# EAGLE design PowerExtractor (EAGLE 6.6.0)
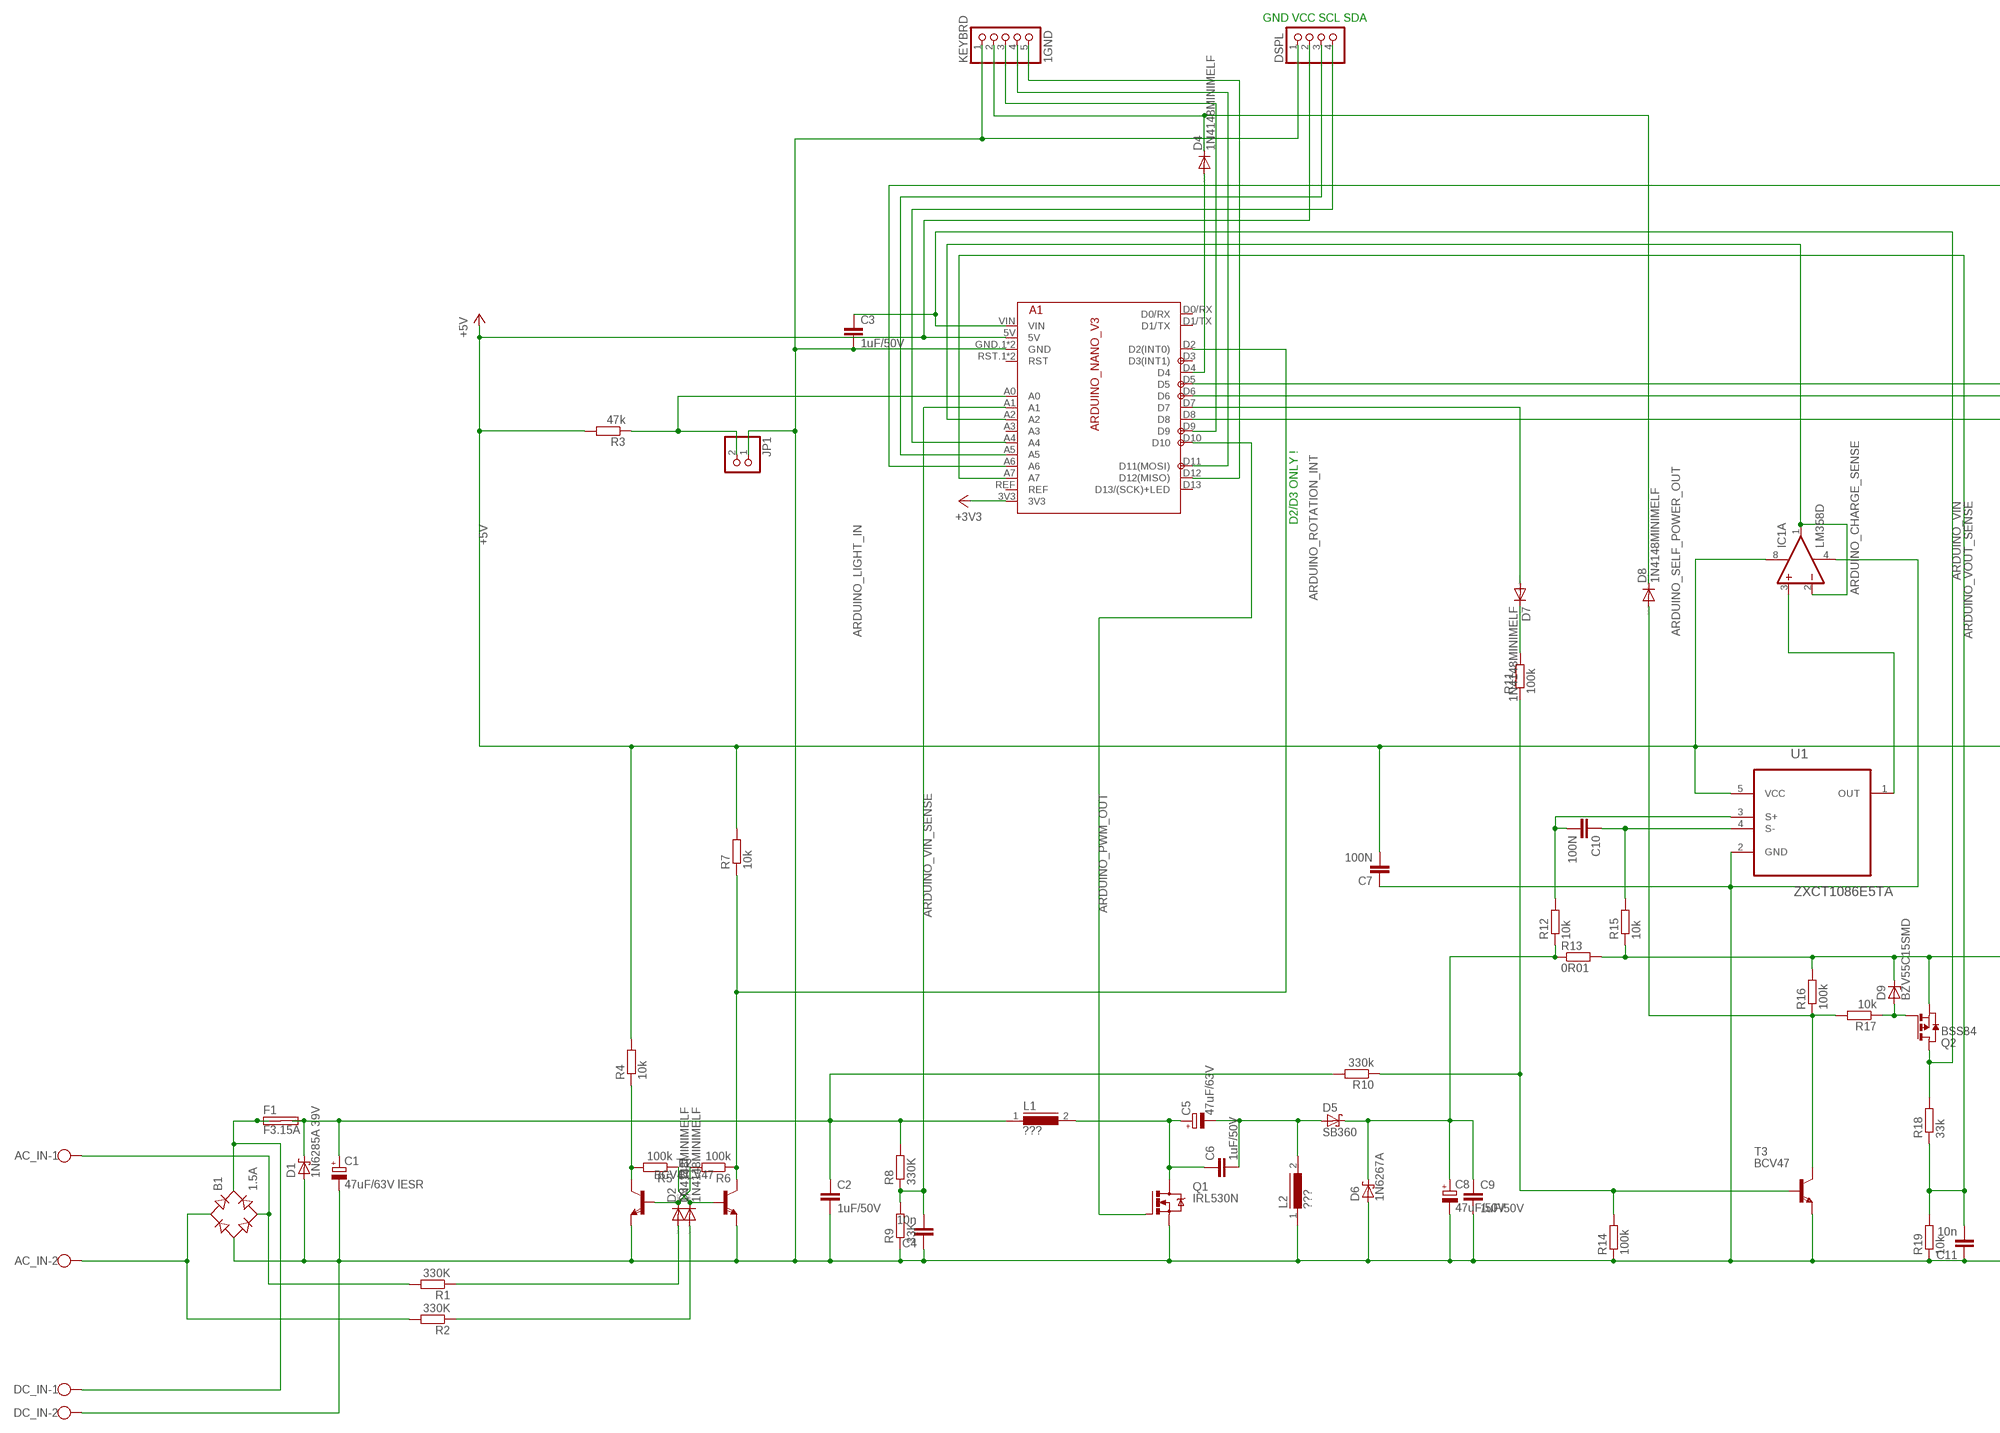
[diagram p0: schematic, sheet 1, part 1 of 2]
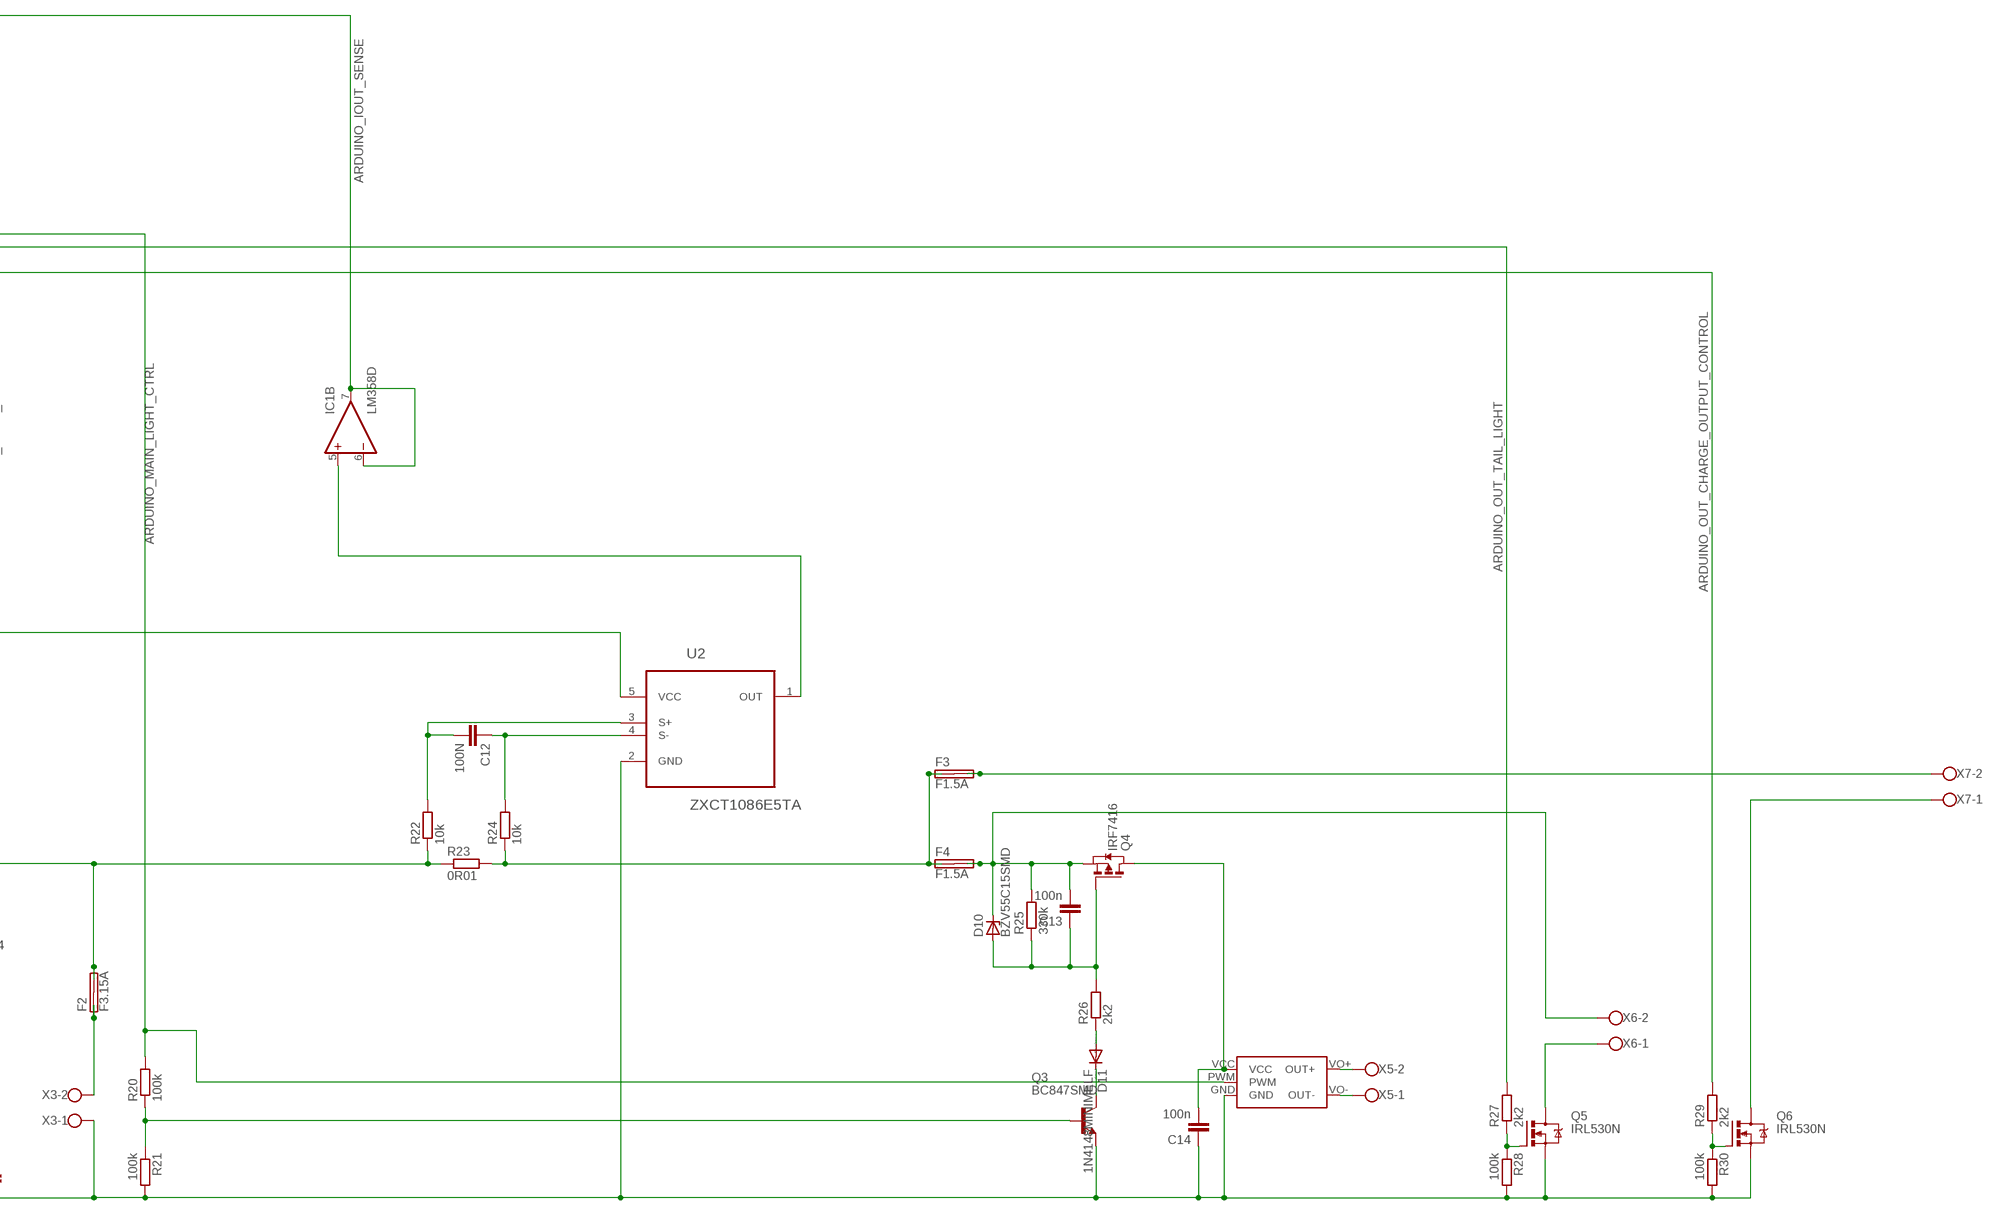
[diagram p1: schematic, sheet 1, part 2 of 2]

## Parts
A1  ARDUINO_NANO_V3  [ARDUINO_NANO_V3]
AC_IN  W237-102  [W237-102]
B1  1.5A  RB1A  [RB1A]
C1  47uF/63V lESR  CPOL-EUE5-8.5  [E5-8,5]
C2  1uF/50V  C-EUC0805  [C0805]
C3  1uF/50V  C-EUC0805  [C0805]
C4  10n  C-EUC0805  [C0805]
C5  47uF/63V  CPOL-EUE5-8.5  [E5-8,5]
C6  1uF/50V  C-EUC0805  [C0805]
C7  100N  C-EUC0805  [C0805]
C8  47uF/50V  CPOL-EUE5-8.5  [E5-8,5]
C9  1uF/50V  C-EUC0805  [C0805]
C10  100N  C-EUC0805  [C0805]
C11  10n  C-EUC0805  [C0805]
C12  100N  C-EUC0805  [C0805]
C13  100n  C-EUC0805  [C0805]
C14  100n  C-EUC0805  [C0805]
D1  1N6285A 39V  1N6267A  [C4111-15]
D2  1N4148MINIMELF  [SOD80C]
D3  1N4148MINIMELF  [SOD80C]
D4  1N4148MINIMELF  [SOD80C]
D5  SB360  1N5908  [C4111-15]
D6  1N6267A  [C4111-15]
D7  1N4148MINIMELF  [SOD80C]
D8  1N4148MINIMELF  [SOD80C]
D9  BZV55C15SMD  ZENER-DIODESOD80C  [SOD80C]
D10  BZV55C15SMD  ZENER-DIODESOD80C  [SOD80C]
D11  1N4148MINIMELF  [SOD80C]
DC_IN  W237-102  [W237-102]
DSPL  PINHD-1X4  [1X04]
F1  F3.15A  SHK20L  [SHK20L]
F2  F3.15A  SHK20L  [SHK20L]
F3  F1.5A  SHK20L  [SHK20L]
F4  F1.5A  SHK20L  [SHK20L]
IC1  LM358D  [SO08]
JP1  PINHD-1X2  [1X02]
KEYBRD  1GND  PINHD-1X5  [1X05]
L1  ???  SFT1030  [SFT1030]
L2  ???  SFT1030  [SFT1030]
Q1  IRL530N  IRF530  [TO220BV]
Q2  BSS84  [SOT23]
Q3  BC847SMD  [SOT23]
Q4  IRF7416  [SO-8]
Q5  IRL530N  IRF530  [TO220BV]
Q6  IRL530N  IRF530  [TO220BV]
R1  330K  R-EU_M0805  [M0805]
R2  330K  R-EU_M0805  [M0805]
R3  47k  R-EU_0207/10  [0207/10]
R4  10k  R-EU_M0805  [M0805]
R5  100k  R-EU_0207/10  [0207/10]
R6  100k  R-EU_R0805  [R0805]
R7  10k  R-EU_R0805  [R0805]
R8  330K  R-EU_M0805  [M0805]
R9  33K  R-EU_R0805  [R0805]
R10  330k  R-EU_R0805  [R0805]
R11  100k  R-EU_M0805  [M0805]
R12  10k  R-EU_M0805  [M0805]
R13  0R01  R-EU_M1206  [M1206]
R14  100k  R-EU_M0805  [M0805]
R15  10k  R-EU_M0805  [M0805]
R16  100k  R-EU_M0805  [M0805]
R17  10k  R-EU_M0805  [M0805]
R18  33k  R-EU_M0805  [M0805]
R19  10k  R-EU_M0805  [M0805]
R20  100k  R-EU_0207/10  [0207/10]
R21  100k  R-EU_M0805  [M0805]
R22  10k  R-EU_M0805  [M0805]
R23  0R01  R-EU_M1206  [M1206]
R24  10k  R-EU_M0805  [M0805]
R25  330k  R-EU_M0805  [M0805]
R26  2k2  R-EU_M0805  [M0805]
R27  2k2  R-EU_0207/10  [0207/10]
R28  100k  R-EU_M0805  [M0805]
R29  2k2  R-EU_0207/10  [0207/10]
R30  100k  R-EU_R0805  [R0805]
T1  BCV47  [SOT23]
T2  BCV47  [SOT23]
T3  BCV47  [SOT23]
U1  ZXCT1086E5TA  [SOT95P280X130-5N]
U2  ZXCT1086E5TA  [SOT95P280X130-5N]
X3  W237-102  [W237-102]
X4  LDD700L  [LDD_700L]
X5  W237-102  [W237-102]
X6  W237-102  [W237-102]
X7  W237-102  [W237-102]

## Nets
+3V3: A1.3V3
+5V: A1.5V C7.2 DSPL.2 IC1.8(P:V+) R3.2 R4.2 R7.2 U1.5(VCC) U2.5(VCC)
+OUT: F3.2A F3.2B X7.2
ARDUINO_CHARGE_SENSE: A1.A2 IC1.1(A:OUT) IC1.2(A:-IN)
ARDUINO_IOUT_SENSE: A1.A6 IC1.6(B:-IN) IC1.7(B:OUT)
ARDUINO_LIGHT_IN: A1.A0 JP1.2 R3.1
ARDUINO_MAIN_LIGHT_CTRL: A1.D5 R20.2 X4.PWM
ARDUINO_OUT_CHARGE_OUTPUT_CONTROL: A1.D8 R29.2
ARDUINO_OUT_TAIL_LIGHT: A1.D6 R27.2
ARDUINO_PWM_OUT: A1.D10 Q1.G
ARDUINO_ROTATION_INT: A1.D2(D2(INT0)) R6.1 R7.1 T2.3(C)
ARDUINO_SELF_POWER_OUT: A1.D7 D7.A
ARDUINO_VIN: A1.VIN C3.1 Q2.3(D) R18.2
ARDUINO_VIN_SENSE: A1.A1 C4.2 R8.1 R9.2
ARDUINO_VOUT_SENSE: A1.A7 C11.2 R18.1 R19.2
BAT+: F2.1A F2.1B X3.2
BAT+FUSED: D9.C F2.2A F2.2B Q2.2(S) R13.2 R15.1 R16.2 R22.1 R23.1
DISPLAY_SCL: A1.A5 DSPL.3
DISPLAY_SDA: A1.A4 DSPL.4
GND: A1.GND.1(GND) A1.GND.2(GND) B1.- C1.- C2.2 C3.2 C4.1 C7.1 C8.- C9.2 C11.1 C14.1 D1.A D6.A DC_IN.2 DSPL.1 IC1.4(P:V-) JP1.1 KEYBRD.1 L2.1 Q1.S Q3.2(E) Q5.S Q6.S R9.1 R14.1 R19.1 R21.2 R28.2 R30.2 T1.2(E) T2.2(E) T3.2(E) U1.2(GND) U2.2(GND) X3.1 X4.GND
HUB1: AC_IN.1 B1.AC2 R1.2
HUB2: AC_IN.2 B1.AC1 R2.2
LIGHTVCC: C13.2 D10.C F4.2A F4.2B Q4.1(S) Q4.2(S) Q4.3(S) R25.2 X6.2
N$1: C10.2 R12.2 U1.3(S+)
N$2: C5.+ C6.1 L1.2 Q1.D
N$3: C5.- C6.2 D5.A L2.2
N$4: R10.1 R11.1 R14.2 T3.1(B)
N$5: IC1.3(A:+IN) U1.1(OUT)
N$6: D4.C D8.C KEYBRD.2
N$7: D9.A Q2.1(G) R17.1
N$8: IC1.5(B:+IN) U2.1(OUT)
N$9: D11.C Q3.3(C)
N$10: B1.+ DC_IN.1 F1.1A F1.1B
N$12: D7.C R11.2
N$13: X4.VO+(OUT+) X5.2
N$14: C13.1 D10.A Q4.4(G) R25.1 R26.2
N$15: X4.VO-(OUT-) X5.1
N$16: C10.1 R15.2 U1.4(S-)
N$17: Q3.1(B) R20.1 R21.1
N$18: D11.A R26.1
N$19: C14.2 Q4.5(D) Q4.6(D) Q4.7(D) Q4.8(D) X4.VCC
N$22: D8.A R16.1 R17.2 T3.3(C)
N$24: Q5.G R27.1 R28.1
N$25: Q5.D X6.1
N$26: A1.D9 KEYBRD.3
N$27: Q6.G R29.1 R30.1
N$28: Q6.D X7.1
N$29: D2.A R1.1
N$30: R4.1 R5.2 T1.3(C)
N$31: D2.C R6.2 T1.1(B)
N$32: D3.C R5.1 T2.1(B)
N$37: A1.D11(D11(MOSI)) KEYBRD.4
N$38: D3.A R2.1
N$39: A1.D12(D12(MISO)) KEYBRD.5
N$41: A1.D4 D4.A
N$46: C12.2 R22.2 U2.3(S+)
N$47: C12.1 R24.2 U2.4(S-)
OUT+SENSED: F3.1A F3.1B F4.1A F4.1B R23.2 R24.1
OUTPUT_TO_SENSE: C8.+ C9.1 D5.C D6.C R12.1 R13.1
VIN: C1.+ C2.1 D1.C F1.2A F1.2B L1.1 R8.2 R10.2
Unconnected: A1.A3 A1.D0/RX A1.D1/TX A1.D3(D3(INT1)) A1.D13(D13/(SCK)+LED) A1.REF A1.RST.1(RST) A1.RST.2(RST)

## Notes on the sheet
- GND VCC SCL SDA
- D2/D3 ONLY !

## Library data of the parts
A1 = triakcz:ARDUINO_NANO_V3
AC_IN DC_IN X3 X5-X7 = con-wago-500:W237-102: WAGO SCREW CLAMP; MPN: 237-102; OC_FARNELL: unknown; OC_NEWARK: 70K9898
B1 = rectifier:RB1A: RECTIFIER 1 A
C1 C5 C8 = rcl:CPOL-EU: POLARIZED CAPACITOR, European symbol
C2-C4 C6 C7 C9-C14 = rcl:C-EU: CAPACITOR, European symbol
D1 D6 = diode:1N6267A: DIODE transient voltage suppressor
D2-D4 D7 D8 D11 = triakcz:1N4148: DIODE high speed (Philips)
D5 = diode:1N5908: DIODE schottky
D9 D10 = diode:ZENER-DIODE: Z-Diode
DSPL = pinhead:PINHD-1X4: PIN HEADER
F1-F4 = fuse:SHK20L: FUSE HOLDER 5 x 20 mm, SH contact, SHH1 Schukat, E1073 Buerklin; OC_FARNELL: unknown; OC_NEWARK: unknown
IC1 = linear:LM358: OP AMP also LM158; LM258; LM2904 Source: http://cache.national.com/ds/LM/LM158.pdf
JP1 = pinhead:PINHD-1X2: PIN HEADER
KEYBRD = pinhead:PINHD-1X5: PIN HEADER
L1 L2 = inductors:SFT1030: INDUCTOR
Q1 Q5 Q6 = transistor-power:IRF530: HEXFET Power MOSFET
Q2 = triakcz:BSS84: P-MOSFET -0.13 A -50 V RDS(ON) = 10 Ω @ Vgs = -5 V Vgsmax=20V
Q3 = triakcz:BC847*: NPN Transistor
Q4 = triakcz:IRF7416
R1-R30 = rcl:R-EU_: RESISTOR, European symbol
T1-T3 = triakcz:BCV47: BCV47 NPN DARL 60V 500mA H21e>20000
U1 U2 = triakcz:ZXCT1086E5TA: PRECISION HIGH VOLTAGE HIGH-SIDE CURRENT MONITORS; MPN: ZXCT1086E5TA; PACKAGE: SOT-25-5; SUPPLIER: DIODES INC.
X4 = triakcz:LDD700L

## Board
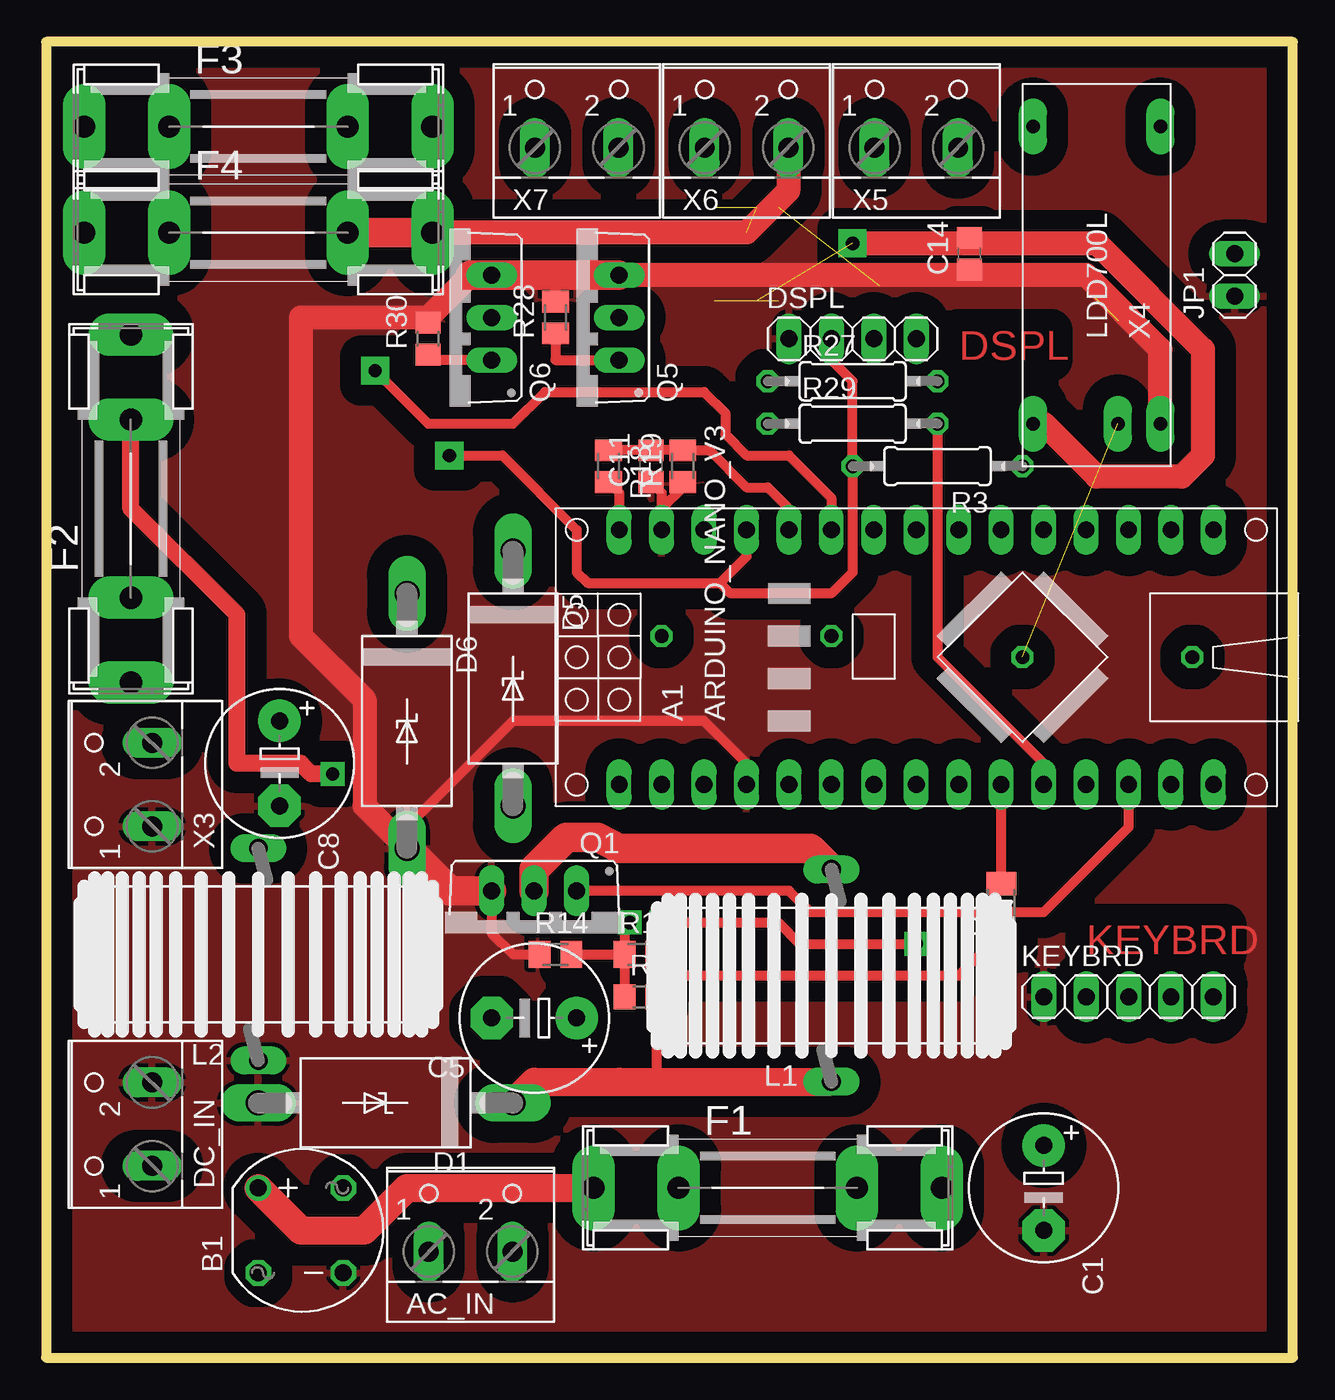
[diagram p2: board, top side]
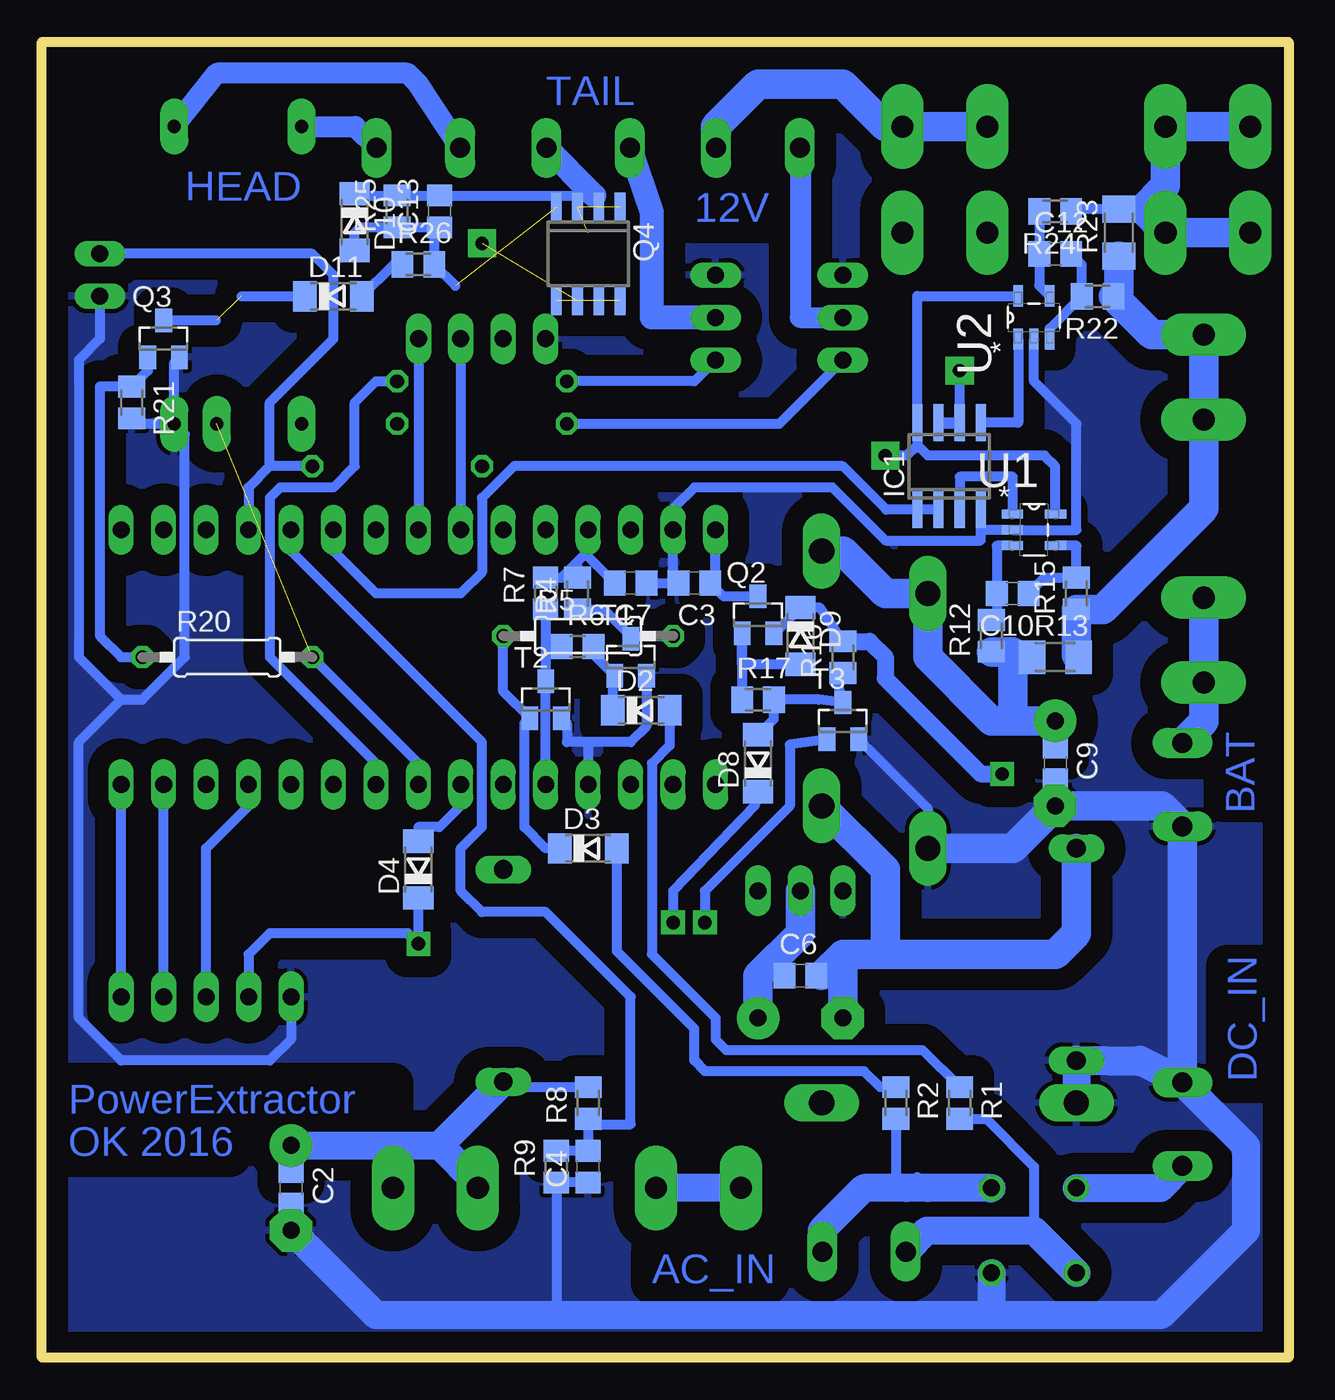
[diagram p3: board, bottom side, seen from below]

Size 74.6 x 78.73 mm. Coordinates in mm from the lower left corner, seen from the top.
Outline: 0,0 74.6,0 74.6,78.73 0,78.73 0,0
Copper layers (1*16): Top 0.035mm / dielectric 1.5mm / Bottom 0.035mm
Design rules "default": minimum track width 10mil, minimum drill 24mil, track to track 8mil, track to pad 8mil, pad to pad 8mil, via to via 8mil, smd to smd 8mil, copper to edge 40mil, drill to drill 8mil, minimum pad ring 10mil, minimum via ring 8mil, stop-mask expansion 4mil, vias tented up to drill 0mil, thermal gap 10mil

### Footprints (pad centres in the part's own frame; a part is rotated, then mirrored left to right if it is on the bottom)
ARDUINO_NANO_V3 = drill 1 long: 3V3 15.24,2.54; 5V 15.24,27.94; A0 15.24,7.62; A1 15.24,10.16; A2 15.24,12.7; A3 15.24,15.24; A4 15.24,17.78; A5 15.24,20.32; A6 15.24,22.86; A7 15.24,25.4; D0/RX 0,33.02; D1/TX 0,35.56; D2 0,25.4; D3 0,22.86; D4 0,20.32; D5 0,17.78; D6 0,15.24; D7 0,12.7; D8 0,10.16; D9 0,7.62; D10 0,5.08; D11 0,2.54; D12 0,0; D13 15.24,0; GND.1 0,27.94; GND.2 15.24,33.02; REF 15.24,5.08; RST.1 0,30.48; RST.2 15.24,30.48; VIN 15.24,35.56
W237-102 = drill 1.194 long: 1 -2.5,-1.27; 2 2.5,-1.27
RB1A = drill 1.016: + -2.54,2.54 | drill 1.016 octagon: - 2.54,-2.54; AC1 2.54,2.54; AC2 -2.54,-2.54
E5-8,5 = drill 1.016 pad 2.54: + -2.54,0 | drill 1.016 pad 2.54 octagon: - 2.54,0
C0805 = smd 1.3 x 1.5: 1 -0.95,0; 2 0.95,0
C4111-15 = drill 1.499 long: A 7.62,0; C -7.62,0
SOD80C = smd 1.4 x 1.8: A 1.7,0; C -1.7,0
1X04 = drill 1.016 long: 1 -3.81,0; 2 -1.27,0; 3 1.27,0; 4 3.81,0
SHK20L = drill 1.321 pad 2.54 long: 1A -10.414,0; 1B -5.334,0; 2A 10.414,0; 2B 5.334,0
SO08 = smd 0.6 x 2.2: 1 -1.905,-2.6; 2 -0.635,-2.6; 3 0.635,-2.6; 4 1.905,-2.6; 5 1.905,2.6; 6 0.635,2.6; 7 -0.635,2.6; 8 -1.905,2.6
1X02 = drill 1.016 long: 1 -1.27,0; 2 1.27,0
1X05 = drill 1.016 long: 1 -5.08,0; 2 -2.54,0; 3 0,0; 4 2.54,0; 5 5.08,0
SFT1030 = drill 1.118 long: 1 -6.35,0; 2 6.35,0
TO220BV = drill 1.016 long: D 0,-2.54; G -2.54,-2.54; S 2.54,-2.54
SOT23 = smd 1 x 1.4: 1 -0.95,-1.1; 2 0.95,-1.1; 3 0,1.1
SO-8 = smd 0.65 x 1.75: 1 -1.905,-2.8; 2 -0.635,-2.8; 3 0.635,-2.8; 4 1.905,-2.8; 5 1.905,2.8; 6 0.635,2.8; 7 -0.635,2.8; 8 -1.905,2.8
M0805 = smd 1.3 x 1.6: 1 -0.95,0; 2 0.95,0
0207/10 = drill 0.813 octagon: 1 -5.08,0; 2 5.08,0
R0805 = smd 1.3 x 1.5: 1 -0.95,0; 2 0.95,0
M1206 = smd 1.6 x 2: 1 -1.4,0; 2 1.4,0
SOT95P280X130-5N = smd 1.27 x 0.559: 1 -1.295,0.94; 2 -1.295,0; 3 -1.295,-0.94; 4 1.295,-0.94; 5 1.295,0.94
LDD_700L = drill 0.8 pad 1.676 long: GND 2.54,0.635; PWM 2.54,3.175; VCC 2.54,8.255; VO+ 20.32,8.255; VO- 20.32,0.635

### Placement (x,y rotation side)
A1  69.85,34.29 90 top
AC_IN  25.4,7.62 0 top
B1  15.24,7.62 0 top
C1  59.69,10.16 270 top
C2  59.69,10.16 270 bottom
C3  35.56,46.36 180 bottom
C4  41.91,11.43 90 bottom
C5  29.21,20.32 180 top
C6  29.21,22.86 0 bottom
C7  39.37,46.36 180 bottom
C8  13.97,35.56 270 top
C9  13.97,35.56 270 bottom
C10  16.51,45.72 180 bottom
C11  36.2,53.34 90 top
C12  13.97,66.04 0 bottom
C13  50.8,68.58 90 bottom
C14  55.24,66.04 90 top
D1  20.32,15.24 180 top
D2  38.73,38.73 0 bottom
D3  41.91,30.48 0 bottom
D4  52.07,29.21 90 bottom
D5  27.94,40.64 270 top
D6  21.59,38.1 270 top
D7  57.15,26.67 90 top
D8  31.75,35.56 90 bottom
D9  29.21,43.18 270 bottom
D10  55.88,67.94 270 bottom
D11  57.15,63.5 0 bottom
DC_IN  5.08,13.97 90 top
DSPL  48.26,60.96 0 top
F1  43.18,10.16 0 top
F2  5.08,50.8 90 top
F3  12.7,73.66 0 top
F4  12.7,67.31 0 top
IC1  20.32,53.34 0 bottom
JP1  71.12,64.77 90 top
KEYBRD  64.77,21.59 0 top
L1  46.99,22.86 90 top
L2  12.7,24.13 90 top
Q1  29.21,25.4 180 top
Q2  31.75,44.45 0 bottom
Q3  67.31,60.96 0 bottom
Q4  41.91,66.04 180 bottom
Q5  31.75,62.23 90 top
Q6  24.13,62.23 90 top
R1  19.68,15.24 270 bottom
R2  23.5,15.24 270 bottom
R3  53.34,53.34 180 top
R4  42.55,45.72 90 bottom
R5  41.91,43.18 0 bottom
R6  42.55,42.55 0 bottom
R7  44.45,45.72 90 bottom
R8  41.91,15.24 90 bottom
R9  43.81,11.43 90 bottom
R10  35.56,21.59 0 top
R11  35.56,24.13 0 top
R12  17.78,43.18 90 bottom
R13  13.97,41.91 0 bottom
R14  30.48,24.13 0 top
R15  12.7,45.72 90 bottom
R16  26.67,41.91 90 bottom
R17  31.75,39.37 0 bottom
R18  33.66,53.34 270 top
R19  38.1,53.34 90 top
R20  63.5,41.91 0 bottom
R21  69.22,57.15 270 bottom
R22  11.43,63.5 180 bottom
R23  10.16,67.31 90 bottom
R24  13.97,68.58 180 bottom
R25  53.34,68.58 90 bottom
R26  52.07,65.4 0 bottom
R27  48.26,58.42 0 top
R28  30.48,62.23 90 top
R29  48.26,55.88 0 top
R30  22.86,60.96 90 top
T1  39.37,41.91 0 bottom
T2  44.45,39.37 0 bottom
T3  26.67,38.1 0 bottom
U1  15.24,49.53 0 bottom
U2  15.24,62.23 90 bottom
X3  5.08,34.29 90 top
X4  67.31,53.34 90 top
X5  52.07,73.66 0 top
X6  41.91,73.66 0 top
X7  31.75,73.66 0 top

### Tracks (layer width: path | path; a pad name or v marks a point on that pad's centre or on a via)
+5V  (via drill 0.8 pad 1.68)
  Top 0.61: v24.13,53.98 27.3,53.98 31.75,49.53 31.75,46.99 32.38,46.36 C7.2 | C7.2 41.91,47.95 A1.5V | C7.2 40.95,45.72 46.99,45.72 48.26,46.99 R3.2 48.26,58.42 46.99,59.69 DSPL.2
  Bottom 0.61: C7.2 41.91,47.95 41.91,48.26 | 41.91,48.26 A1.5V | U2.5 22.23,63.52 IC1.8 22.23,54.61 | U1.5 13.97,50.49 13.97,53.34 14.61,53.98 21.59,53.98 22.23,54.61 | 22.23,54.61 22.86,53.98 v24.13,53.98 | R7.2 43.5,46.67 42.55,47.62 | R4.2 42.55,47.62 | 42.55,47.62 41.91,48.26
+OUT
  Bottom 0.61: F3.2A 24.13,73.66
  Bottom 1.778: F3.2B F3.2A | 24.13,73.66 26.67,76.2 31.75,76.2 34.29,73.66 34.29,72.43 X7.2
ARDUINO_CHARGE_SENSE
  Bottom 0.61: IC1.2 IC1.1 24.07,50.74 26.67,53.34 46.35,53.34 48.26,51.44 48.26,46.99 49.53,45.72 54.61,45.72 57.15,48.26 A1.A2
ARDUINO_IOUT_SENSE  (via drill 0.8 pad 1.68)
  Top 0.61: v19.68,59.05 22.86,55.88 27.94,55.88 29.84,57.79 39.37,57.79 40.64,56.52 40.64,55.24 41.91,53.98 44.45,53.98 46.99,51.44 A1.A6
  Bottom 0.61: IC1.6 IC1.7 20.95,55.88 19.68,55.88 v19.68,59.05
ARDUINO_LIGHT_IN
  Bottom 0.61: R3.1 60.96,53.34 | 60.96,53.34 62.23,52.07 A1.A0 | 60.96,53.34 60.96,57.15 57.15,60.96 57.15,64.77 58.42,66.04 JP1.2
ARDUINO_MAIN_LIGHT_CTRL  (1 unrouted)
  Bottom 0.61: R20.2 52.07,35.56 A1.D5
ARDUINO_OUT_CHARGE_OUTPUT_CONTROL
  Top 0.61: R29.2 53.34,41.91 59.69,35.56 A1.D8
ARDUINO_OUT_TAIL_LIGHT
  Bottom 0.61: A1.D6 54.61,35.56 60.96,41.91 60.96,51.44 60.33,52.07 57.15,52.07 55.88,53.34 55.88,57.15 54.61,58.42 R27.2
ARDUINO_PWM_OUT
  Top 0.61: A1.D10 64.77,31.75 59.69,26.67 45.72,26.67 44.45,27.94 Q1.G
ARDUINO_ROTATION_INT
  Bottom 0.61: R7.1 44.45,43.18 | 44.45,43.18 T2.3 A1.D2 | R6.1 43.81,42.55 44.45,43.18
ARDUINO_SELF_POWER_OUT
  Top 0.61: 57.15,33.02 A1.D7 D7.A
ARDUINO_VIN
  Top 0.61: R18.2 34.29,51.76 A1.VIN
  Bottom 0.61: A1.VIN 34.29,46.36 C3.1 33.8,45.55 Q2.3
ARDUINO_VIN_SENSE
  Bottom 0.61: A1.A1 59.69,48.26 48.26,36.83 48.26,31.75 49.53,30.48 49.53,27.94 48.26,26.67 44.45,26.67 39.37,21.59 39.37,13.97 41.91,13.97 R8.1 C4.2 R9.2
ARDUINO_VOUT_SENSE
  Top 0.61: A1.A7 44.45,50.8 43.18,52.07 41.91,52.07 39.69,54.29 R19.2 C11.2 R18.1
BAT+
  Bottom 1.778: F2.1B F2.1A 5.08,38.06 X3.2
BAT+FUSED  (via drill 0.8 pad 1.42)
  Top 1.016: v17.14,34.93 15.88,34.93 15.24,35.56 11.43,35.56 11.43,44.45 5.08,50.8 F2.2B
  Bottom 0.61: R13.2 12.7,42.04 | 10.16,63.82 R22.1 | R16.2 28.05,44.88 D9.C 30.74,43.35 Q2.2
  Bottom 1.016: R16.2 25.08,42.86 24.13,41.91 24.13,40.64 18.41,34.93 v17.14,34.93
  Bottom 1.778: 12.7,42.04 R15.1 11.11,44.77 5.08,50.8 F2.2B F2.2A 8.19,61.21 R22.1 | R23.1 10.16,63.82
DISPLAY_SCL
  Bottom 0.61: DSPL.3 A1.A5
DISPLAY_SDA
  Bottom 0.61: DSPL.4 A1.A4
GND
  Top 0.61: A1.GND.1 41.91,35.56 39.37,38.1 27.94,38.1 21.59,31.75 D6.A | R30.2 22.86,62.23 | R28.2 30.48,64.77 | C14.1 55.56,64.77 | R19.1 38.1,52.07 36.83,50.8 | C11.1 36.83,51.76 36.83,50.8 | 36.83,50.8 A1.GND.2 | Q1.S 26.67,25.4 27.94,24.13 R14.1
  Top 1.422: 25.4,64.77 22.86,62.23 15.24,62.23 15.24,43.18 19.05,39.37 19.05,33.02 D6.A | X4.GND 66.67,60.33 62.23,64.77 55.56,64.77 Q5.S
  Top 1.778: D6.A 24.13,27.94 Q1.S | Q5.S 30.48,64.77 Q6.S 25.4,64.77
  Bottom 0.61: 8.93,17.74 DC_IN.2 7.58,16.47 6.35,16.51 | L2.1 8.89,17.78 | C7.1 36.83,46.36 | 36.83,46.36 A1.GND.2 36.83,50.8 35.56,52.07 27.3,52.07 24.13,48.9 18.41,48.9 18.41,49.53 | C3.2 36.83,46.36 | 18.41,49.53 U1.2 12.7,49.53 12.7,55.88 15.24,58.42 U2.2 | C9.2 C8.- | IC1.4 18.41,49.53 | X4.GND 66.67,59.55 Q3.2 | R21.2 68.89,55.88 X4.GND | T2.2 43.18,37.95 43.18,36.83 41.91,36.83 | T1.2 38.42,37.78 39.37,36.83 41.91,36.83 | 41.91,36.83 A1.GND.1 | T3.2 21.59,32.87 D6.A | JP1.1 71.12,60.96 72.39,59.69 72.39,41.91 69.85,39.37 | 69.85,39.37 68.58,39.37 66.04,41.91 66.04,55.24 X4.GND | KEYBRD.1 59.69,19.05 60.96,17.78 69.85,17.78 72.39,20.32 72.39,36.83 69.85,39.37 | C4.1 R9.1 43.81,3.17 43.18,2.54
  Bottom 1.016: C1.- C2.2
  Bottom 1.676: DC_IN.2 2.54,12.66 2.54,7.62 7.62,2.54 17.78,2.54 | 17.78,2.54 43.18,2.54 54.61,2.54 C1.- | B1.- 17.78,2.54 | L2.1 D1.A
  Bottom 1.778: L2.1 8.93,17.74 | D6.A 16.51,30.48 C8.- 7.58,33.02 X3.1 6.35,16.51 8.89,17.78
  pour Top (isolate 1.27): 0,78.74 74.93,78.74 74.93,0 0,0
  pour Bottom (isolate 1.27): 0,78.74 74.93,78.74 74.93,0 0,0
HUB1
  Bottom 0.61: 15.24,7.62 15.24,11.43 18.1,14.29 R1.2
  Bottom 1.676: AC_IN.1 21.63,7.62 15.24,7.62 B1.AC2
HUB2
  Bottom 0.61: 22.23,10.8 21.59,10.16 | R2.2 23.5,10.8 22.86,10.16
  Bottom 1.676: B1.AC1 17.82,10.12 17.86,10.16 21.59,10.16 22.86,10.16 25.4,10.16 27.94,7.62 27.9,7.58 AC_IN.2
LIGHTVCC  (3 unrouted)
  Top 0.61: X6.2 44.41,71.38
  Top 1.422: X6.2 44.41,69.81 41.91,67.31 F4.2A
  Top 1.778: F4.2A F4.2B
  Bottom 0.61: 41.55,69.53 C13.2 R25.2 55.36,69.53 D10.C
  Bottom 1.422: 41.55,69.53 X6.2
N$1
  Bottom 0.61: U1.3 17.46,48.59 C10.2 17.46,44.45 R12.2
N$2
  Top 1.778: L1.2 45.72,30.48 34.29,30.48 33.02,31.12 31.11,31.12 29.21,29.21 Q1.D
  Bottom 0.61: C6.1 31.75,22.86
  Bottom 1.778: Q1.D 29.21,25.4 31.75,22.86 C5.+
N$3
  Bottom 0.61: 27.94,22.86 C6.2
  Bottom 1.778: C5.- 26.67,24.13 | L2.2 12.7,25.4 13.97,24.13 24.13,24.13 | 24.13,24.13 26.67,24.13 | D5.A 24.13,29.21 24.13,24.13 | 26.67,24.13 27.94,22.86
N$4  (via drill 0.8 pad 1.42)
  Top 0.61: R14.2 R11.1 | R11.1 R10.1 | v34.92,26.04 34.61,25.72 R11.1
  Bottom 0.61: T3.1 29.84,36.68 29.84,33.02 34.92,27.94 v34.92,26.04
N$5
  Bottom 0.61: U1.1 16.51,50.47 16.51,52.7 19.68,52.7 IC1.3
N$6  (via drill 0.8 pad 1.42)
  Top 0.61: v36.83,26.04 43.81,26.04 45.09,24.77 v52.07,24.77
  Bottom 0.61: D8.C 31.95,33.02 36.83,27.94 v36.83,26.04 | D4.C v52.07,24.77 52.7,25.4 60.96,25.4 62.23,24.13 KEYBRD.2
N$7
  Bottom 0.61: R17.1 Q2.1 32.7,41.48 D9.A
N$8
  Bottom 0.61: U2.1 16.18,55.94 IC1.5
N$9  (1 unrouted)
  Bottom 0.61: 64.17,62.06 Q3.3 | 62.66,63.5 D11.C
N$10
  Top 1.676: B1.+ 15.24,7.62 19.05,7.62 21.59,10.16 F1.1A
  Bottom 1.676: F1.1A F1.1B | B1.+ 7.66,10.16 DC_IN.1
N$12
  Top 0.61: R11.2 37.78,22.86 54.61,22.86 56.72,24.97 D7.C
N$13
  Bottom 1.27: X4.VO+ 55.84,73.66 X5.2
N$14  (1 unrouted)
  Bottom 0.61: D10.A 55.88,67.31 55.56,67.63 R25.1 C13.1 51.12,67.31 R26.2 49.85,64.13
N$15
  Bottom 1.27: X5.1 52.11,76.24 52.7,76.83 64.14,76.83 X4.VO-
N$16
  Bottom 0.61: C10.1 14.61,46.67 R15.2 12.7,48.59 U1.4
N$17
  Bottom 0.61: Q3.1 68.26,59.05 R21.1 71.12,58.1 71.12,43.18 69.85,41.91 R20.1
N$18
  Bottom 0.61: D11.A 53.55,65.4 R26.1
N$19  (via drill 0.8 pad 1.68)  (4 unrouted)
  Top 0.61: C14.2 54.93,66.67 54.61,66.67
  Top 1.422: v48.26,66.67 54.61,66.67 | 54.93,66.67 62.87,66.67 69.22,60.33 69.22,53.98 67.94,52.7 62.87,52.7 59.69,55.88 X4.VCC
N$22
  Bottom 0.61: R16.1 26.99,40.47 T3.3 28.11,39.37 R17.2 30.8,38.21 D8.A
N$24
  Top 0.61: R28.1 30.48,59.69 Q5.G
  Bottom 0.61: Q5.G 35.56,58.42 R27.1
N$25
  Bottom 1.422: Q5.D 38.1,62.23 38.1,68.54 X6.1
N$26
  Bottom 0.61: KEYBRD.3 64.77,30.48 62.23,33.02 A1.D9
N$27
  Top 0.61: Q6.G 23.18,59.69 R30.1
  Bottom 0.61: R29.1 30.48,55.88 Q6.G
N$28
  Bottom 0.61: 29.21,72.35 X7.1
  Bottom 1.27: 29.21,72.35 29.21,62.23 Q6.D
N$29
  Bottom 0.61: D2.A 37.03,36.62 38.1,35.56 38.1,24.13 34.29,20.32 34.29,19.05 33.66,18.41 21.91,18.41 R1.1
N$30
  Bottom 0.61: R4.1 40.96,44.77 39.37,43.18 | 39.37,43.18 R5.2 | T1.3 39.37,43.18
N$31
  Bottom 0.61: D2.C 40.44,40.7 T1.1 41.59,42.09 R6.2
N$32
  Bottom 0.61: R5.1 46.99,39.86 T2.1 45.72,37.95 45.72,31.75 44.45,30.48 D3.C
N$37
  Bottom 0.61: KEYBRD.4 A1.D11
N$38
  Bottom 0.61: D3.A 40.21,24.34 35.56,19.69 35.56,17.78 34.92,17.14 25.4,17.14 24.45,16.19 R2.1
N$39
  Bottom 0.61: KEYBRD.5 A1.D12
N$41
  Bottom 0.61: A1.D4 49.53,33.02 50.8,31.75 52.07,31.75 D4.A
N$46
  Bottom 0.61: U2.3 14.3,61.58 R22.2 12.38,65.4 C12.2
N$47
  Bottom 0.61: R24.2 C12.1 14.92,64.14 U2.4
OUT+SENSED
  Bottom 0.61: 8.77,68.71 R23.2 12.89,68.71 R24.1
  Bottom 1.778: F4.1A F4.1B 8.77,68.71 7.37,70.11 F3.1B F3.1A
OUTPUT_TO_SENSE
  Bottom 0.61: C9.1 C8.+ | R12.1 17.46,41.91 R13.1
  Bottom 1.778: D5.C 26.67,48.26 24.13,45.72 D6.C 21.59,41.91 17.78,38.1 16.51,38.1 | 16.51,38.1 C8.+ | R12.1 16.51,42.23 16.51,38.1
VIN
  Top 0.61: R10.2 36.51,16.51 34.29,16.51
  Top 1.676: D1.C 29.21,16.51 34.29,16.51 L1.1
  Bottom 0.61: L1.1 46.99,16.19 R8.2
  Bottom 1.016: C1.+ C2.1
  Bottom 1.676: C1.+ 53.34,12.7 | 53.34,12.7 50.8,12.7 | 50.8,12.7 L1.1 | F1.2B 48.51,10.41 50.8,12.7 | F1.2A 53.59,12.45 53.34,12.7

### Text on the board
Top: DSPL | KEYBRD
Bottom: TAIL | HEAD | 12V | BAT | DC_IN | PowerExtractor | OK 2016 | AC_IN